# EAGLE design MAX30100 (EAGLE 7.4.0)
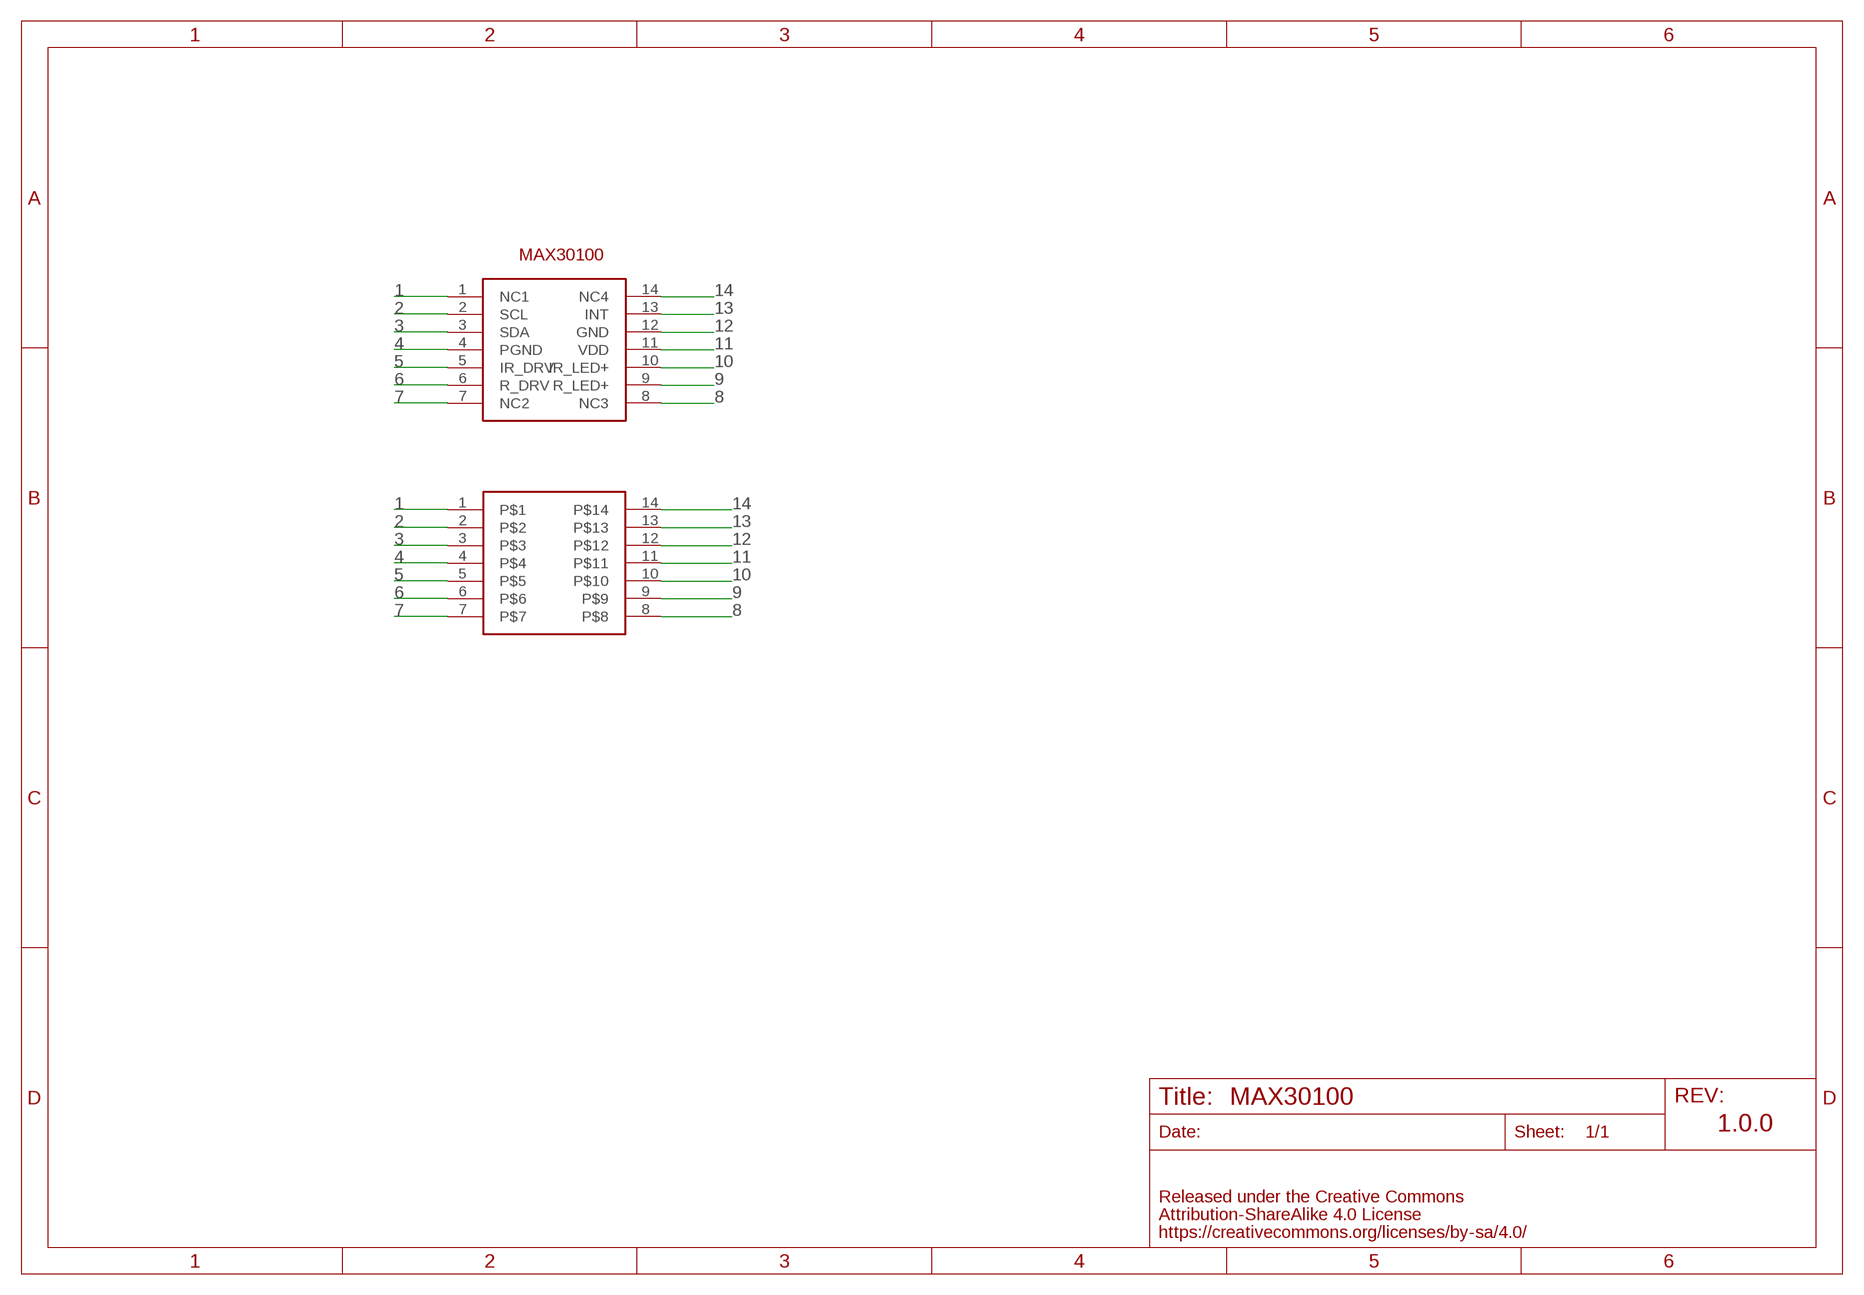
[diagram p0: schematic, sheet 1]

## Parts
MAX30100  MA-MAX30100  [MAXIM-30100]
U$2  14PIN  [14PIN]

## Nets
1: MAX30100.1(NC1) U$2.1
2: MAX30100.2(SCL) U$2.2
3: MAX30100.3(SDA) U$2.3
4: MAX30100.4(PGND) U$2.4
5: MAX30100.5(IR_DRV) U$2.5
6: MAX30100.6(R_DRV) U$2.6
7: MAX30100.7(NC2) U$2.7
8: MAX30100.8(NC3) U$2.8
9: MAX30100.9(R_LED+) U$2.9
10: MAX30100.10(IR_LED+) U$2.10
11: MAX30100.11(VDD) U$2.11
12: MAX30100.12(GND) U$2.12
13: MAX30100.13(INT) U$2.13
14: MAX30100.14(NC4) U$2.14

## Notes on the sheet
- 1.0.0

## Library data of the parts
MAX30100 = FaBo-Mems:MA-MAX30100
U$2 = FaBo-Breakout:14PIN

## Board
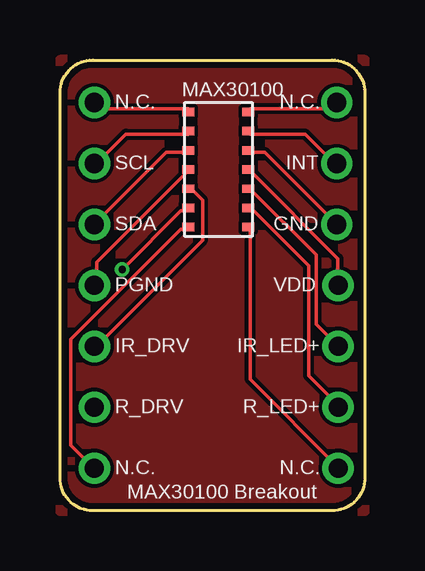
[diagram p1: board, top side]
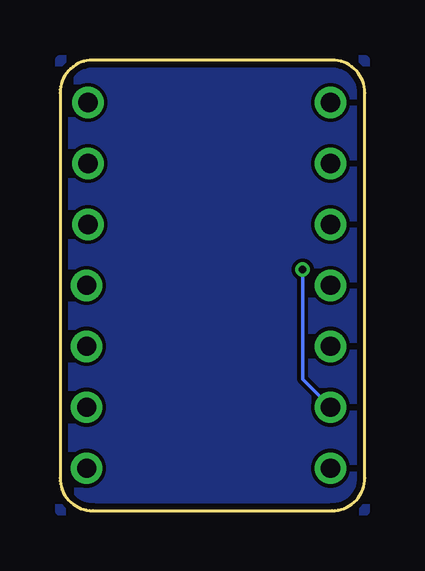
[diagram p2: board, bottom side, seen from below]

Size 12.7 x 18.78 mm. Coordinates in mm from the lower left corner, seen from the top.
Copper layers (1*16): Top 0.035mm / dielectric 1.5mm / Bottom 0.035mm
Design rules "Elecrow_2-layer_eagle_rule": minimum track width 6mil, minimum drill 12mil, track to track 6mil, track to pad 6mil, pad to pad 6mil, via to via 6mil, smd to smd 0mil, copper to edge 10mil, drill to drill 10mil, minimum pad ring 10mil, minimum via ring 6mil, stop-mask expansion 2mil, vias tented up to drill 100mil, thermal gap 10mil

### Footprints (pad centres in the part's own frame; a part is rotated, then mirrored left to right if it is on the bottom)
MAXIM-30100 = smd 0.5 x 0.35: 1 -1.25,2.4; 2 -1.25,1.6; 3 -1.25,0.8; 4 -1.25,0; 5 -1.25,-0.8; 6 -1.25,-1.6; 7 -1.25,-2.4; 8 1.25,-2.4; 9 1.25,-1.6; 10 1.25,-0.8; 11 1.25,0; 12 1.25,0.8; 13 1.25,1.6; 14 1.25,2.4
14PIN = drill 0.8: 1 -4.92,7.62; 2 -4.92,5.08; 3 -4.92,2.54; 4 -4.92,0; 5 -4.92,-2.54; 6 -4.92,-5.08; 7 -4.92,-7.62; 8 5.24,-7.62; 9 5.24,-5.08; 10 5.24,-2.54; 11 5.24,0; 12 5.18,2.54; 13 5.18,5.08; 14 5.18,7.62

### Placement (x,y rotation side)
MAX30100  6.6,14.22 0 top
U$2  6.35,9.39 0 top

### Tracks (layer width: path | path; a pad name or v marks a point on that pad's centre or on a via)
1
  Top 0.152: MAX30100.1 5.33,16.76 1.68,16.76 1.52,16.91 U$2.1
2
  Top 0.152: MAX30100.2 5.33,15.69 2.74,15.69 1.52,14.47 U$2.2
3
  Top 0.152: MAX30100.3 5.33,14.93 4.42,14.93 1.52,12.03 U$2.3
4
  Top 0.152: MAX30100.4 5.33,14.17 1.52,10.36 1.52,9.44 U$2.4
5
  Top 0.152: MAX30100.5 5.49,13.4 5.94,12.95 5.94,11.27 1.52,6.85 U$2.5
6  (via drill 0.3)
  Top 0.152: v2.59,10.05 5.03,12.49 5.33,12.49 MAX30100.6
  Bottom 0.152: v2.59,10.05 2.59,5.48 1.52,4.41 U$2.6
7
  Top 0.152: MAX30100.7 5.33,11.73 5.03,11.73 0.46,7.16 0.46,2.74 1.37,1.82 U$2.7
8
  Top 0.152: MAX30100.8 7.92,11.73 7.92,5.48 11.58,1.82 U$2.8
9
  Top 0.152: MAX30100.9 7.92,12.49 8.08,12.49 10.36,10.2 10.36,5.63 11.58,4.41 U$2.9
10
  Top 0.152: MAX30100.10 7.92,13.4 10.67,10.66 10.67,7.76 U$2.10
11
  Top 0.152: MAX30100.11 7.92,14.17 11.58,10.51 11.58,9.44 U$2.11
12
  Top 0.152: MAX30100.12 7.92,14.93 8.53,14.93 11.43,12.03 U$2.12
13
  Top 0.152: MAX30100.13 7.92,15.69 10.21,15.69 11.43,14.47 U$2.13
14
  Top 0.152: MAX30100.14 7.92,16.76 11.28,16.76 11.43,16.91 U$2.14
GND
  pour Top: 0,-0.01 12.7,-0.01 12.7,18.79 0,18.79
  pour Bottom: 0,-0.01 12.7,-0.01 12.7,18.79 0,18.79

### Text on the board
tPlace: N.C. | N.C. | SCL | INT | SDA | GND | PGND | VDD | IR_DRV | IR_LED+ | R_DRV | R_LED+ | N.C. | N.C. | MAX30100 Breakout